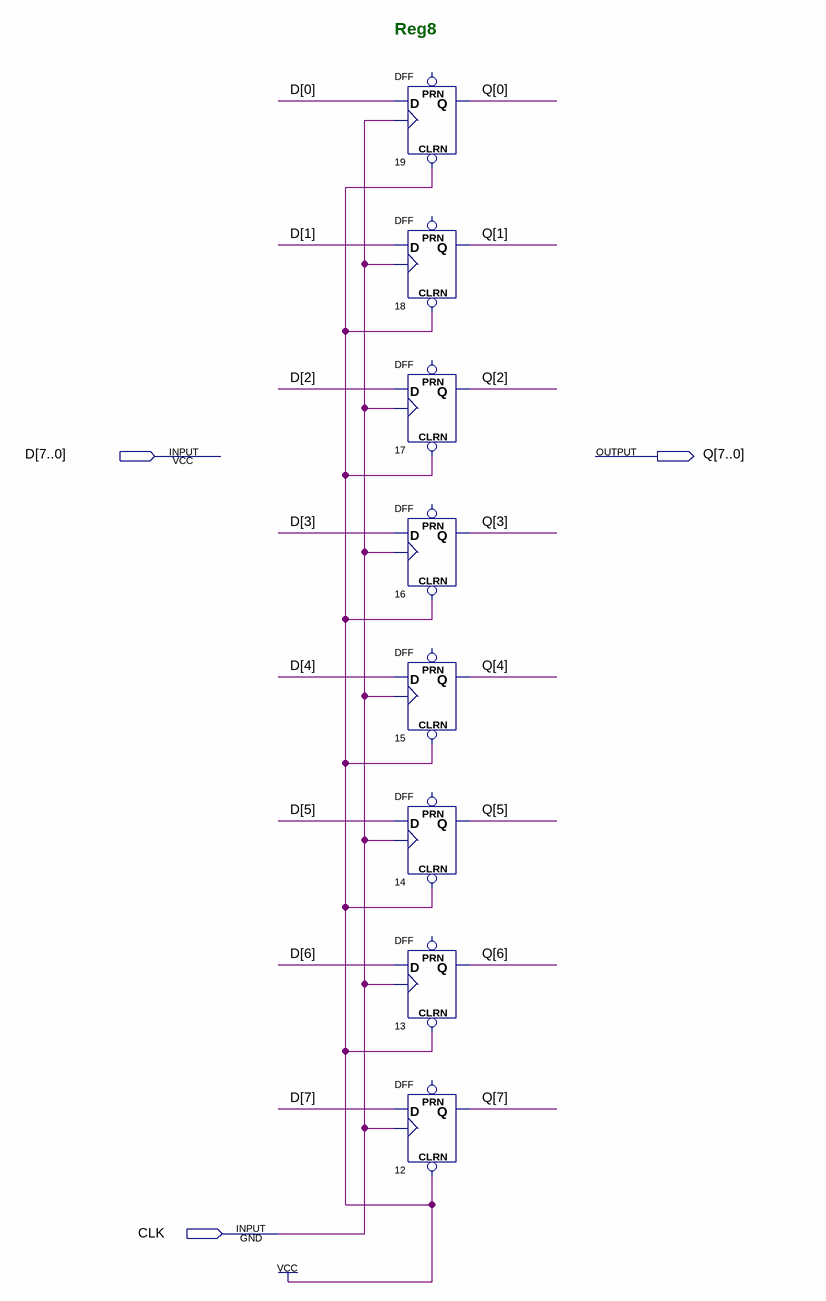
[diagram p0: schematic sheet]
// Quartus schematic Reg8.bdf as structural Verilog: 8 symbols, 3 pins
module Reg8 (
  input  [7:0] D,
  input  CLK,
  output [7:0] Q
);

  DFF u_19 (.CLRN(1'b1), .CLK(CLK), .D(D[0]), .Q(Q[0]));  // open: PRN
  DFF u_18 (.CLRN(1'b1), .CLK(CLK), .D(D[1]), .Q(Q[1]));  // open: PRN
  DFF u_17 (.CLRN(1'b1), .CLK(CLK), .D(D[2]), .Q(Q[2]));  // open: PRN
  DFF u_16 (.CLRN(1'b1), .CLK(CLK), .D(D[3]), .Q(Q[3]));  // open: PRN
  DFF u_15 (.CLRN(1'b1), .CLK(CLK), .D(D[4]), .Q(Q[4]));  // open: PRN
  DFF u_14 (.CLRN(1'b1), .CLK(CLK), .D(D[5]), .Q(Q[5]));  // open: PRN
  DFF u_13 (.CLRN(1'b1), .CLK(CLK), .D(D[6]), .Q(Q[6]));  // open: PRN
  DFF u_12 (.CLRN(1'b1), .CLK(CLK), .D(D[7]), .Q(Q[7]));  // open: PRN

  // Notes on the sheet:
  //   Reg8
endmodule
